# EAGLE design uLI-04 (EAGLE 9.2.2)
AUTHOR: M. Petrilak, J. Horacek; VERSION: 04 r3
Assembly variants: master, slave

## Sheet 1 of 2
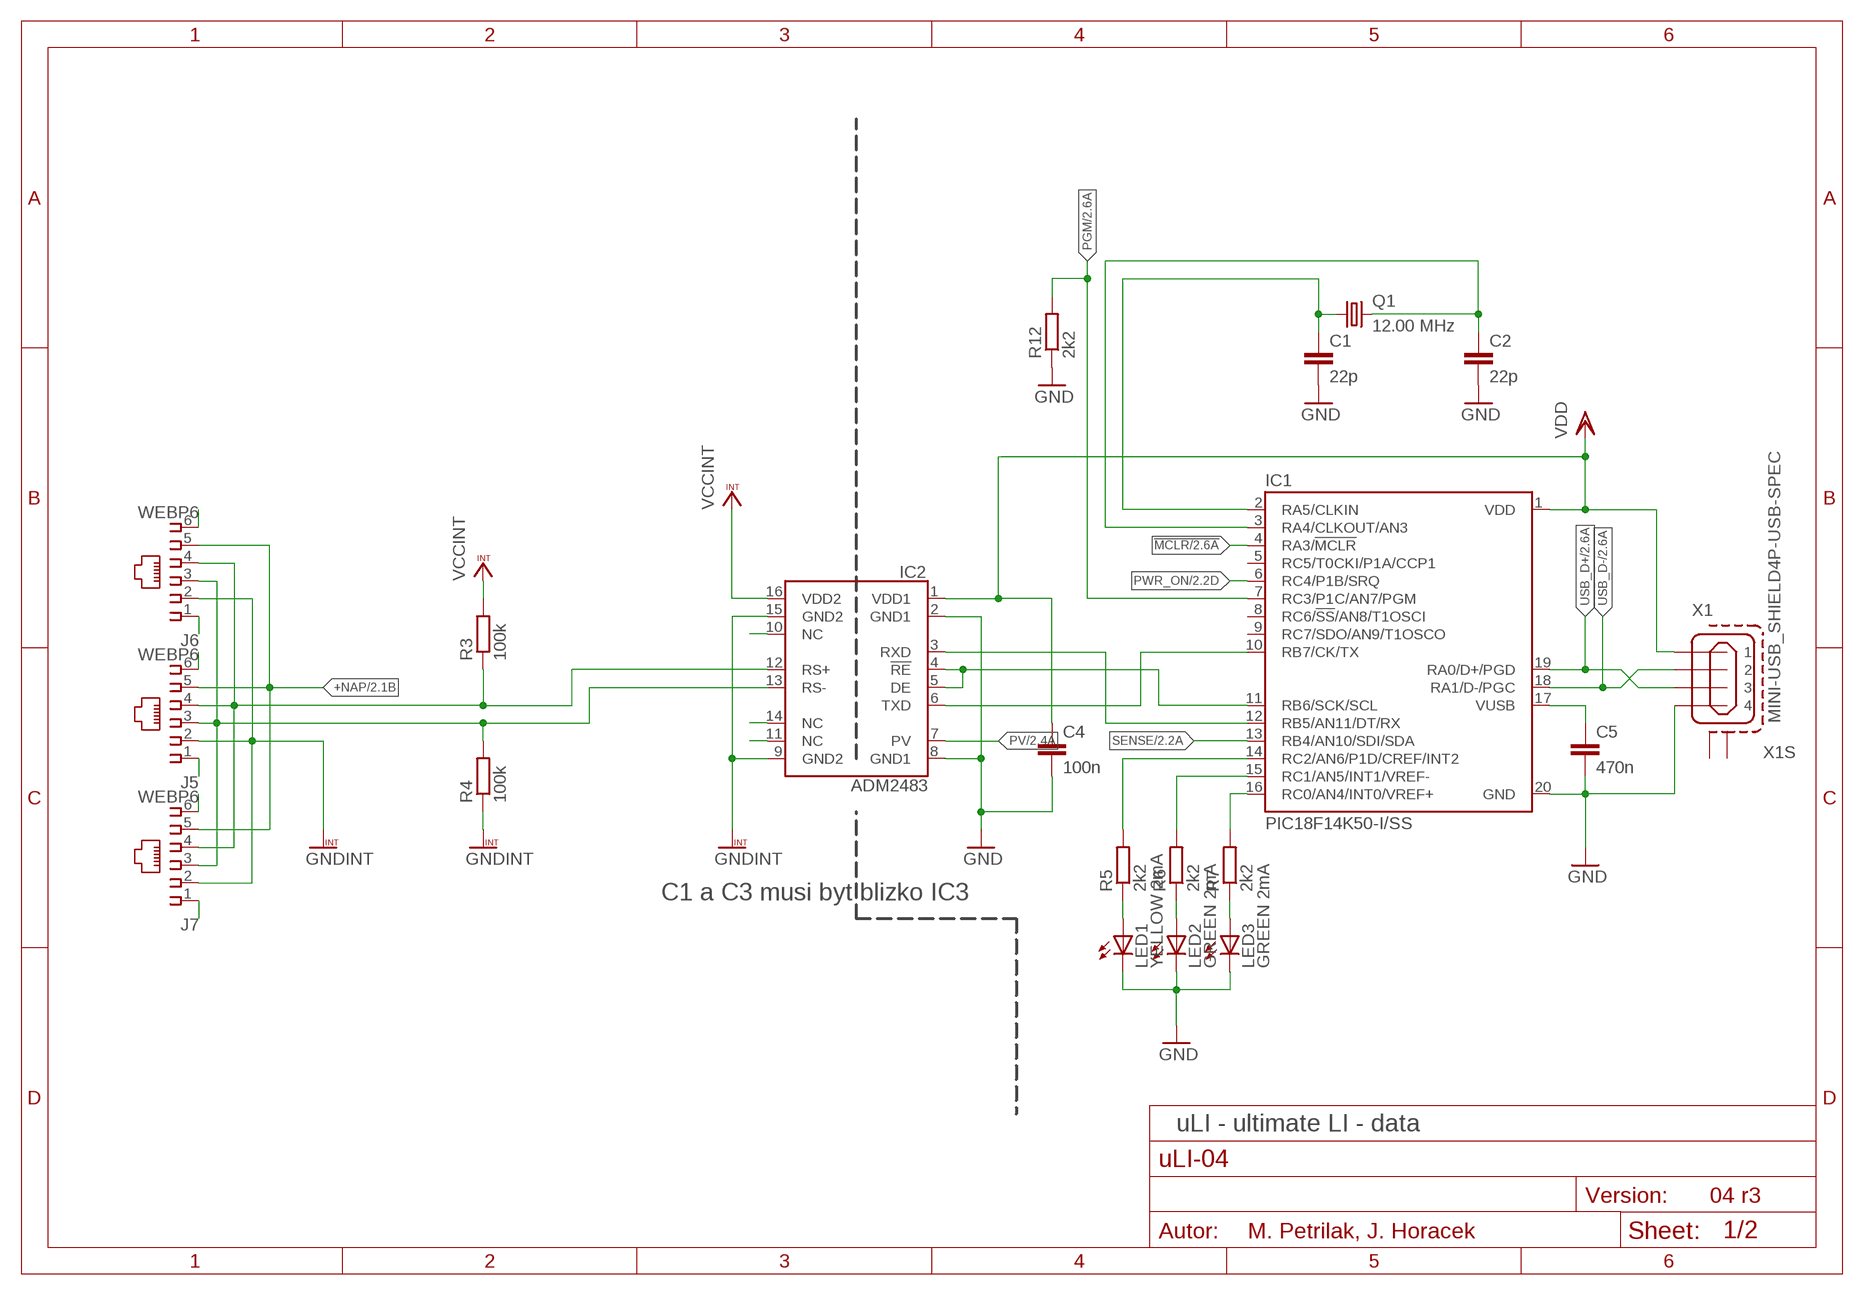
[diagram p0: schematic, sheet 1]

### Parts
C1  22p  C-EUC0805  [C0805]
C2  22p  C-EUC0805  [C0805]
C4  100n  C-EUC1206  [C1206]
C5  470n  C-EUC1206  [C1206]
IC1  PIC18F14K50-I/SS  [SSOP20]
IC2  ADM2483  [SO-16W]
J5  WEBP6  WEBP6-6_SPEC2  [WEBP6-6_SPEC2]  (not fitted in variant slave)
J6  WEBP6  WEBP6-6_SPEC2  [WEBP6-6_SPEC2]  (not fitted in variant slave)
J7  WEBP6  WEBP6-6_SPEC2  [WEBP6-6_SPEC2]  (not fitted in variant master)
LED1  YELLOW 2mA  LED3MM  [LED3MM]
LED2  GREEN 2mA  LED3MM  [LED3MM]
LED3  GREEN 2mA  LED3MM  [LED3MM]
Q1  12.00 MHz  XTAL  [HC49U70]
R3  100k  R-EU_R1206  [R1206]
R4  100k  R-EU_R1206  [R1206]
R5  2k2  R-EU_R1206  [R1206]
R6  2k2  R-EU_R1206  [R1206]
R7  2k2  R-EU_R1206  [R1206]
R12  2k2  R-EU_R1206  [R1206]
X1  MINI-USB_SHIELD4P-USB-SPEC  [85-32004-10X-SPEC]

### Nets
!MCLR: IC1.4(RA3/!MCLR!) ; also sheet 2
+NAP [BUS]: J5.5 J6.5 J7.5 ; also sheet 2
BUS_A [BUS]: IC2.12(RS+) J5.4 J6.4 J7.4 R3.1
BUS_B [BUS]: IC2.13(RS-) J5.3 J6.3 J7.3 R4.2
GND: C1.2 C2.2 C4.2 C5.2 IC1.20(GND) IC2.2(GND1) IC2.8(GND1) LED1.K(C) LED2.K(C) LED3.K(C) R12.1 X1.4 ; also sheet 2
GNDINT [BUS]: IC2.9(GND2) IC2.15(GND2) J5.2 J6.2 J7.2 R4.1 ; also sheet 2
LED1: IC1.14(RC2/AN6/P1D/CREF/INT2) R5.2
LED1_R: LED1.A R5.1
LED2: IC1.15(RC1/AN5/INT1/VREF-) R6.2
LED2_R: LED2.A R6.1
LED3: IC1.16(RC0/AN4/INT0/VREF+) R7.2
LED3_R: LED3.A R7.1
N$2 [BUS]: IC2.11(NC)
N$3 [BUS]: IC2.10(NC)
N$5: IC1.12(RB5/AN11/DT/RX) IC2.3(RXD)
N$8 [BUS]: J6.6
N$11 [BUS]: J6.1
N$12 [BUS]: J5.6
N$13 [BUS]: J5.1
N$14 [BUS]: J7.6
N$15 [BUS]: J7.1
NC2 [BUS]: IC2.14(NC)
PGM: IC1.7(RC3/P1C/AN7/PGM) R12.2 ; also sheet 2
PROC_RX: IC1.10(RB7/CK/TX) IC2.6(TXD)
PROC_TE: IC1.11(RB6/SCK/SCL) IC2.4(!RE) IC2.5(DE)
PV: IC2.7(PV) ; also sheet 2
PWR_ON: IC1.6(RC4/P1B/SRQ) ; also sheet 2
SENSE: IC1.13(RB4/AN10/SDI/SDA) ; also sheet 2
USB_D+: IC1.19(RA0/D+/PGD) X1.3 ; also sheet 2
USB_D-: IC1.18(RA1/D-/PGC) X1.2 ; also sheet 2
VBUS: C5.1 IC1.17(VUSB)
VCCINT [BUS]: IC2.16(VDD2) R3.2 ; also sheet 2
VDD: C4.1 IC1.1(VDD) IC2.1(VDD1) X1.1 ; also sheet 2
XTAL1: C1.1 IC1.2(RA5/CLKIN) Q1.1
XTAL2: C2.1 IC1.3(RA4/CLKOUT/AN3) Q1.2
Unconnected: IC1.5(RC5/T0CKI/P1A/CCP1) IC1.8(RC6/!SS!/AN8/T1OSCI) IC1.9(RC7/SDO/AN9/T1OSCO) X1.M1(S1) X1.M2(S2)

### Notes on the sheet
- C1 a C3 musi byt blizko IC3
- uLI - ultimate LI - data

## Sheet 2 of 2
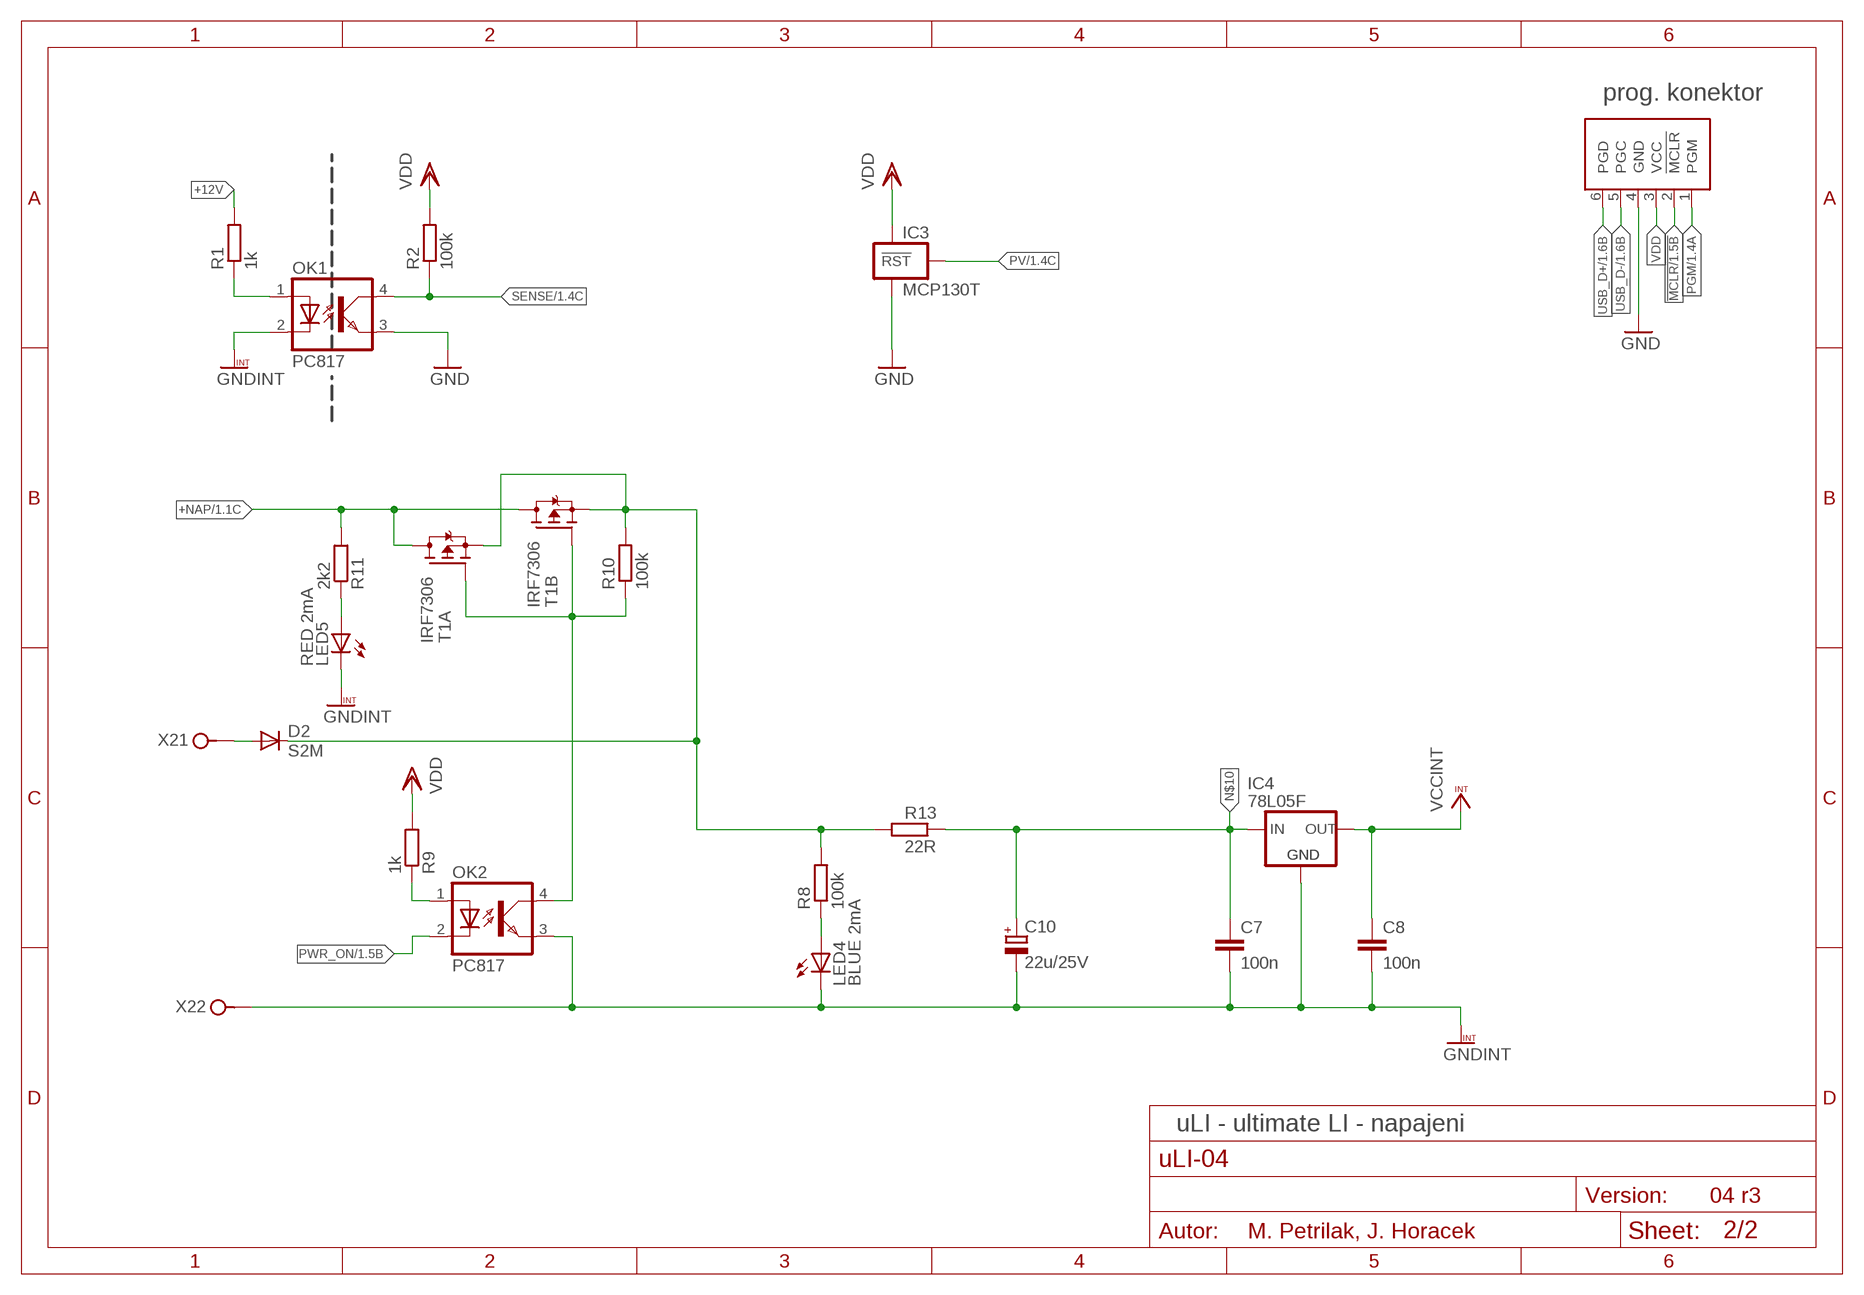
[diagram p1: schematic, sheet 2]

### Parts
C7  100n  C-EUC1206  [C1206]
C8  100n  C-EUC1206  [C1206]
C10  22u/25V  CPOL-EUE2-5  [E2-5]
D2  S2M  [SMB]  (not fitted in variant slave)
IC3  MCP130T  [SOT23]
IC4  78L05F  [SOT89]
J1  PICPROG2-V  [6410-06-PICPROG]
LED4  BLUE 2mA  LED3MM  [LED3MM]  (not fitted in variant slave)
LED5  RED 2mA  LED3MM  [LED3MM]
OK1  PC817  [DIL04]  (not fitted in variant slave)
OK2  PC817  [DIL04]  (not fitted in variant slave)
R1  1k  R-EU_R1206  [R1206]  (not fitted in variant slave)
R2  100k  R-EU_R1206  [R1206]  (not fitted in variant slave)
R8  100k  R-EU_R1206  [R1206]  (not fitted in variant slave)
R9  1k  R-EU_R1206  [R1206]  (not fitted in variant slave)
R10  100k  R-EU_R1206  [R1206]
R11  2k2  R-EU_R1206  [R1206]
R13  22R  R-EU_R1206  [R1206]  (variant master: 0R)
T1  IRF7306  [SO08-IRF]
X2  ARK1550/2_S  [ARK1550/2_SPEC]  (not fitted in variant slave)

### Nets
!MCLR: J1.2(!MCLR) ; also sheet 1
+12V [BUS]: D2.C R1.2 R8.2 R10.2 R13.2 T1.1(A:S) T1.3(B:S)
+NAP [BUS]: R11.2 T1.5(B:D) T1.6(B:D) T1.7(A:D) T1.8(A:D) ; also sheet 1
+NAP2 [BUS]: D2.A X2.1
BUS_SENSE [BUS]: OK1.1(A) R1.1
GND: IC3.3(GND) J1.4(GND) OK1.3(EMIT) ; also sheet 1
GNDINT [BUS]: C7.2 C8.2 C10.- IC4.2(GND) IC4.2@1(GND) LED4.K(C) LED5.K(C) OK1.2(C) OK2.3(EMIT) X2.2 ; also sheet 1
N$1 [BUS]: LED4.A R8.1
N$4 [BUS]: LED5.A R11.1
N$6 [BUS]: OK2.4(COL) R10.1 T1.2(A:G) T1.4(B:G)
N$7: OK2.1(A) R9.1
N$10 [BUS]: C7.1 C10.+ IC4.3(VI) R13.1
PGM: J1.1(PGM) ; also sheet 1
PV: IC3.1(!RST) ; also sheet 1
PWR_ON: OK2.2(C) ; also sheet 1
SENSE: OK1.4(COL) R2.1 ; also sheet 1
USB_D+: J1.6(PGD) ; also sheet 1
USB_D-: J1.5(PGC) ; also sheet 1
VCCINT [BUS]: C8.1 IC4.1(VO) ; also sheet 1
VDD: IC3.2(VCC) J1.3(VCC) R2.2 R9.2 ; also sheet 1

### Notes on the sheet
- prog. konektor
- uLI - ultimate LI - napajeni

## Library data of the parts
C1 C2 C4 C5 C7 C8 = rcl:C-EU: CAPACITOR, European symbol
C10 = rcl:CPOL-EU: POLARIZED CAPACITOR, European symbol
D2 = diode:S2M
IC1 = microchip:PIC18*K50: PIC with USB
IC2 = my:ADM2483
IC3 = my:MCP130T
IC4 = linear:78L*: POSITOIV-VOLTAGE REGULATORS Output up to 100 mA Source: http://focus.ti.com/lit/ds/symlink/ua78l05.pdf
J1 = con-molex:PICPROG2
J5-J7 = con-malina:WEBP6-6
LED1-LED5 = led:LED: LED OSRAM: - CHIPLED LG R971, LG N971, LY N971, LG Q971, LY Q971, LO R971, LY R971 LH N974, LH R974 LS Q976, LO Q976, LY Q976 LO Q996 - Hyper CHIPLED LW Q18S LB Q993, LB Q99A, LB R99A - SideLED LS A670, LO A670, LY A670, LG A670, LP A670 LB A673, LV A673, LT A673, LW A673 LH A674 LY A675 LS A676, LA A676, LO A676, LY A676, LW A676 LS A679, LY A679, LG A679 - Hyper Micro SIDELED® LS Y876, LA Y876, LO Y876, LY Y876 LT Y87S - SmartLED LW L88C, LW L88S LB L89C, LB L89S, LG L890 LS L89K, LO L89K, LY L89K LS L896, LA L896, LO L896, LY L896 - TOPLED LS T670, LO T670, LY T670, LG T670, LP T670 LSG T670, LSP T670, LSY T670, LOP T670, LYG T670 LG T671, LOG T671, LSG T671 LB T673, LV T673, LT T673, LW T673 LH T674 LS T676, LA T676, LO T676, LY T676, LB T676, LH T676, LSB T676, LW T676 LB T67C, LV T67C, LT T67C, LS T67K, LO T67K, LY T67K, LW E67C LS E67B, LA E67B, LO E67B, LY E67B, LB E67C, LV E67C, LT E67C LW T67C LS T679, LY T679, LG T679 LS T770, LO T770, LY T770, LG T770, LP T770 LB T773, LV T773, LT T773, LW T773 LH T774 LS E675, LA E675, LY E675, LS T675 LS T776, LA T776, LO T776, LY T776, LB T776 LHGB T686 LT T68C, LB T68C - Hyper Mini TOPLED® LB M676 - Mini TOPLED Santana® LG M470 LS M47K, LO M47K, LY M47K Source: http://www.osram.convergy.de LUXEON: - LUMILED® LXK2-PW12-R00, LXK2-PW12-S00, LXK2-PW14-U00, LXK2-PW14-V00 LXK2-PM12-R00, LXK2-PM12-S00, LXK2-PM14-U00 LXK2-PE12-Q00, LXK2-PE12-R00, LXK2-PE12-S00, LXK2-PE14-T00, LXK2-PE14-U00 LXK2-PB12-K00, LXK2-PB12-L00, LXK2-PB12-M00, LXK2-PB14-N00, LXK2-PB14-P00, LXK2-PB14-Q00 LXK2-PR12-L00, LXK2-PR12-M00, LXK2-PR14-Q00, LXK2-PR14-R00 LXK2-PD12-Q00, LXK2-PD12-R00, LXK2-PD12-S00 LXK2-PH12-R00, LXK2-PH12-S00 LXK2-PL12-P00, LXK2-PL12-Q00, LXK2-PL12-R00 Source: www.luxeon.com KINGBRIGHT: KA-3528ASYC Source: www.kingbright.com
OK1 OK2 = optocoupler:PC817: SHARP OPTO COUPLER
Q1 = crystal:XTAL
R1-R13 = rcl:R-EU_: RESISTOR, European symbol
T1 = transistor-fet:IRF7306
X1 = con-cypressindustries:MINI-USB_SHIELD4P-: MINI USB 4 Pol. Source: www.cypressindustries.com
X2 = con-malina:ARK1550/2

## Net classes
0 default: width 0.3 mm
1 BUS: clearance 3 mm to class 0

## Board
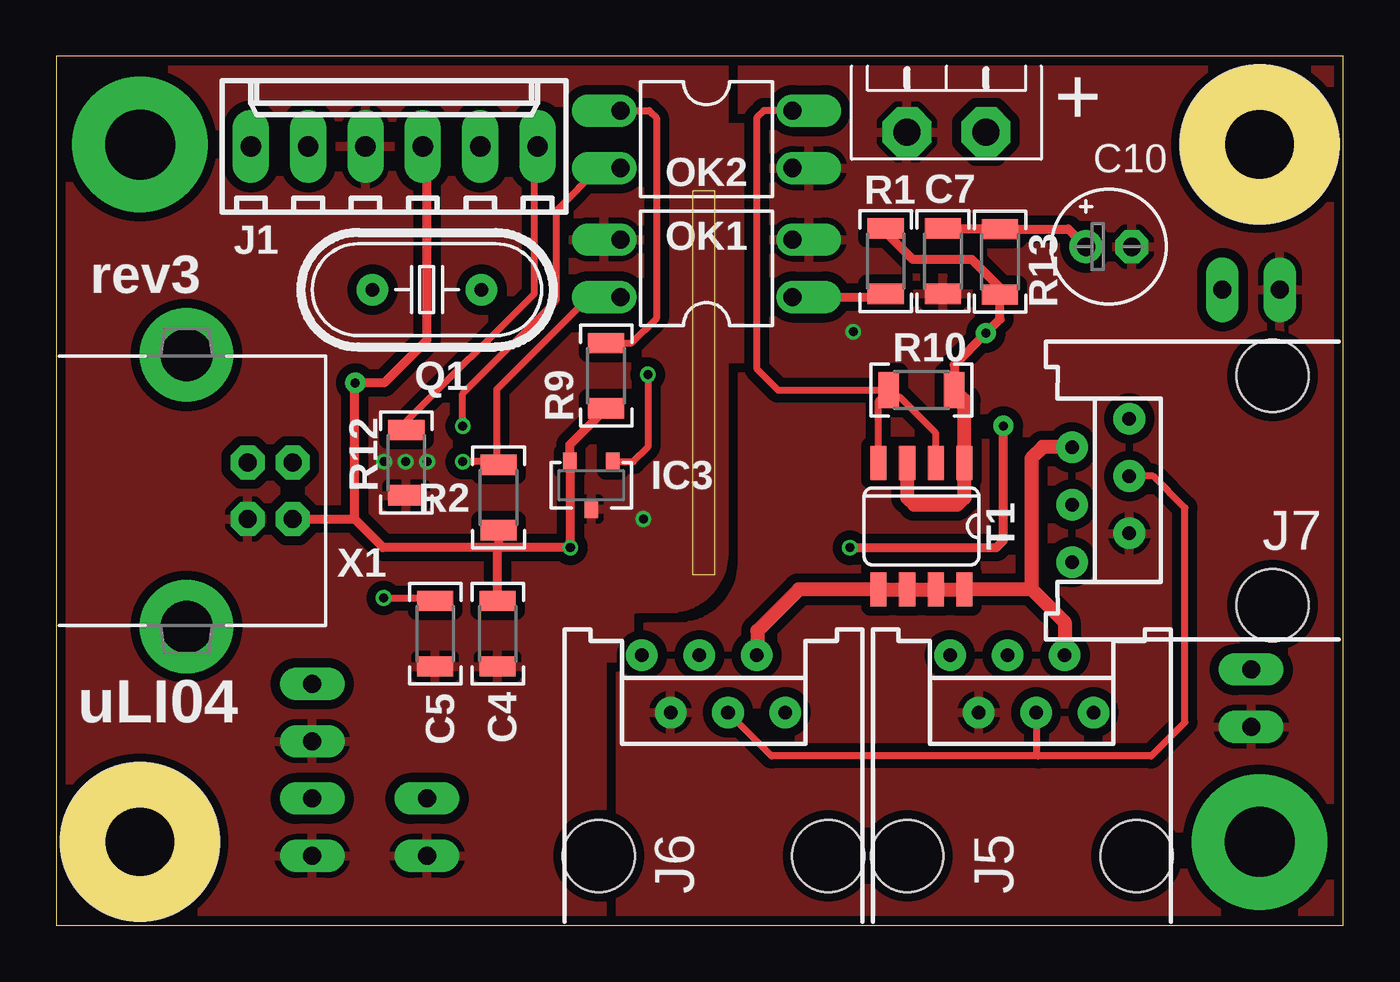
[diagram p2: board, top side]
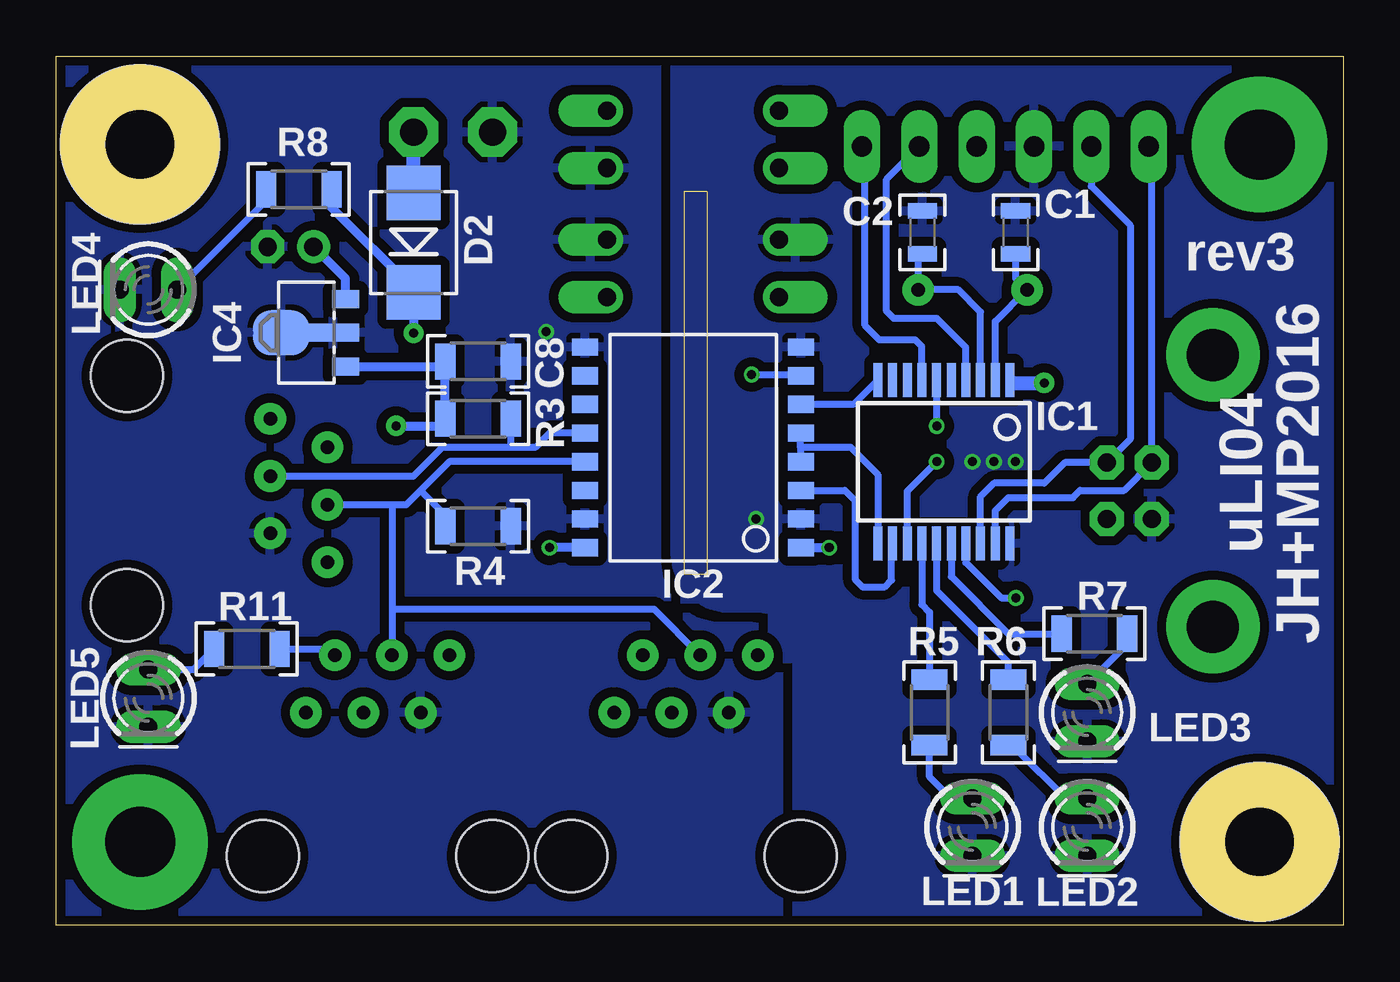
[diagram p3: board, bottom side, seen from below]

Size 57 x 38.5 mm. Coordinates in mm from the lower left corner, seen from the top.
Outline: 0,0 57,0 57,38.5 0,38.5 0,0
Copper layers (1*16): Top 0.035mm / dielectric 1.6mm / Bottom 0.035mm
Design rules "jlcpcb-2layers": minimum track width 5mil, minimum drill 0.3mm, track to track 5mil, track to pad 5mil, pad to pad 5mil, via to via 5mil, smd to smd 5mil, copper to edge 0.2mm, drill to drill 6mil, minimum pad ring 10mil, minimum via ring 3mil, stop-mask expansion 4mil, vias tented up to drill 0mil, thermal gap 10mil
Holes 7 mm at 3.7,3.7 53.3,34.6
Milling: area 1.2,1.2 to 6.2,6.2; area 50.8,32.1 to 55.8,37.1; 4 lines

### Footprints (pad centres in the part's own frame; a part is rotated, then mirrored left to right if it is on the bottom)
C0805 = smd 0.7 x 1.3: 1 -0.95,0; 2 0.95,0
C1206 = smd 0.9 x 1.6: 1 -1.45,0; 2 1.45,0
E2-5 = drill 0.813 pad 1.422: + -1.016,0 | drill 0.813 pad 1.422 octagon: - 1.016,0
SMB = smd 2.4 x 2.4: A 2.2,0; C -2.2,0
SSOP20 = smd 0.4 x 1.5: 1 -2.925,-3.625; 2 -2.275,-3.625; 3 -1.625,-3.625; 4 -0.975,-3.625; 5 -0.325,-3.625; 6 0.325,-3.625; 7 0.975,-3.625; 8 1.625,-3.625; 9 2.275,-3.625; 10 2.925,-3.625; 11 2.925,3.625; 12 2.275,3.625; 13 1.625,3.625; 14 0.975,3.625; 15 0.325,3.625; 16 -0.325,3.625; 17 -0.975,3.625; 18 -1.625,3.625; 19 -2.275,3.625; 20 -2.925,3.625
SO-16W = smd 0.762 x 1.143: 1 -5.08,-4.788; 2 -3.81,-4.788; 3 -2.54,-4.788; 4 -1.27,-4.788; 5 0,-4.788; 6 1.27,-4.788; 7 2.54,-4.788; 8 3.81,-4.788; 9 3.81,4.788; 10 2.54,4.788; 11 1.27,4.788; 12 0,4.788; 13 -1.27,4.788; 14 -2.54,4.788; 15 -3.81,4.788; 16 -5.08,4.788
SOT23 = smd 0.6 x 0.8: 1 -0.95,-1.05; 2 0.95,-1.05; 3 0,1.05
SOT89 = smd 0.8 x 1.2: 1 -1.5,-1.75; 3 1.499,-1.75 | smd 0.8 x 2.3: 2 0,-1.2 | smd 2 x 2.5: 2@1 0,1.1
6410-06-PICPROG = drill 0.9 long: 1 6.35,0; 2 3.81,0; 3 1.27,0; 4 -1.27,0; 5 -3.81,0; 6 -6.35,0
WEBP6-6_SPEC2 = drill 0.6 pad 1.4: 1 -3.175,8.89; 2 -1.905,6.35; 3 -0.635,8.89; 4 0.635,6.35; 5 1.905,8.89; 6 3.175,6.35 | hole 3.2: -5.08,0; 5.08,0
LED3MM = drill 0.8 pad 1.4 long: A -1.27,0; K 1.27,0
DIL04 = drill 0.8 pad 1.4 offset: 1 -1.27,-3.81; 2 1.27,-3.81; 3 1.27,3.81; 4 -1.27,3.81
HC49U70 = drill 0.6 pad 1.4: 1 -2.413,0; 2 2.413,0
R1206 = smd 0.9 x 1.6: 1 -1.45,0; 2 1.45,0
SO08-IRF = smd 0.72 x 1.5: 1 -1.905,-2.8; 2 -0.635,-2.8; 3 0.635,-2.8; 4 1.905,-2.8; 5 1.905,2.8; 6 0.635,2.8; 7 -0.635,2.8; 8 -1.905,2.8
85-32004-10X-SPEC = drill 0.8 pad 1.5 octagon: 1 4.71,-1.25; 2 4.71,1.25; 3 2.71,1.25; 4 2.71,-1.25 | drill 2.3 pad 3: M1 0,6.02; M2 0,-6.02
ARK1550/2_SPEC = drill 1.2 pad 2.184 octagon: 1 0,0; 2 3.5,0

### Placement (x,y rotation side)
C1  14.51,30.7 90 bottom
C2  18.64,30.7 90 bottom
C4  19.55,12.92 270 top
C5  16.78,12.92 270 top
C7  39.27,29.43 270 top
C8  38.32,24.99 0 bottom
C10  46.62,30.07 0 top
D2  41.18,30.25 90 bottom
IC1  17.68,20.54 180 bottom
IC2  28.8,21.81 90 bottom
IC3  MCP130T-3V  [SOT23]  23.7,19.5 180 top
IC4  45.94,26.26 90 bottom
J1  14.96,34.51 0 top
J5  42.77,3.08 0 top
J6  29.11,3.08 0 top
J7  53.88,19.27 90 top
LED1  16.41,4.35 270 bottom
LED2  11.34,4.35 270 bottom
LED3  11.34,9.43 270 bottom
LED4  52.93,28.16 180 bottom
LED5  52.93,10.06 270 bottom
OK1  28.8,29.11 90 top
OK2  28.8,34.83 270 top
Q1  16.41,28.16 0 top
R1  36.73,29.43 90 top
R2  19.59,18.95 270 top
R3  38.32,22.45 180 bottom
R4  38.32,17.68 180 bottom
R5  18.32,9.43 90 bottom
R6  14.83,9.43 90 bottom
R7  11.02,12.92 180 bottom
R8  46.26,32.61 0 bottom
R9  24.35,24.35 270 top
R10  38.32,23.72 0 top
R11  48.56,12.25 0 bottom
R12  15.5,20.5 90 top
R13  41.8,29.4 270 top
T1  38.32,17.68 180 top
X1  5.76,19.25 0 top
X2  41.18,35.15 180 top

### Tracks (layer width: path | path; a pad name or v marks a point on that pad's centre or on a via)
!MCLR
  Bottom 0.305: IC1.4 16.71,25.6 18,26.89 19.91,26.89 20.23,27.21 20.23,33.06 J1.2
+12V  (via drill 0.4 pad 0.9)
  Top 0.406: R1.2 36.8,30.82 36.8,30.65 37.95,29.5 40.55,29.5 41.8,28.25 R13.2 41.8,26.86 v41.18,26.24 39.77,24.83 R10.2
  Top 0.61: T1.3 37.69,18.95 38.01,18.64 39.91,18.64 40.23,18.95 T1.1 40.23,23.26 R10.2
  Bottom 0.406: v41.18,26.24 D2.C 41.18,28.18 44.81,31.81 R8.2
+NAP
  Top 0.61: J7.5 44.97,21.2 43.7,21.2 43.2,20.7 43.2,14.9 | 43.2,14.9 41.77,14.9 41.76,14.89 T1.8 T1.7 T1.6 T1.5 32.88,14.89 31.05,13.05 31.05,12 J6.5 | 43.2,14.9 44.67,13.43 J5.5
  Bottom 0.305: R11.2 44.95,12.25 J5.5
+NAP2
  Bottom 0.61: D2.A X2.1
BUS_A
  Top 0.305: J6.4 31.68,7.5 43.5,7.5 | 43.5,7.5 48.5,7.5 50,9 50,18.5 48.59,19.91 J7.4 | J5.4 43.4,7.6 43.5,7.5
  Bottom 0.305: IC2.12 35.15,21.81 35.78,21.18 36.73,21.18 | 36.73,21.18 39.91,21.18 41.18,19.91 J7.4 47.53,19.73 | R3.1 36.87,21.32 36.73,21.18
BUS_B
  Bottom 0.305: IC2.13 39.59,20.54 40.86,19.27 | R4.2 39.77,18.18 40.86,19.27 | J7.3 42.1,18.64 | 42.1,18.64 41.5,18.64 40.86,19.27 | J5.3 42.1,12 42.1,14 | 42.1,14 42.1,18.64 | J6.3 30.51,14 42.1,14
BUS_SENSE
  Top 0.406: OK1.1 36.6,27.84 R1.1
GND  (via drill 0.4 pad 0.7)
  other vias: 26,18 15.46,20.54 14.51,20.54 16.41,20.54
  pour Top (isolate 0.406, rank 6): 0,0 57,0 57,38.5 0,38.5
  pour Bottom (isolate 0.406, rank 6): 0,0 57,0 57,38.5 0,38.5
GNDINT  (via drill 0.4 pad 0.7)
  other vias: 35.3,26.3
  pour Top (isolate 0.406): 30.38,38.5 57,38.5 57,0 24.99,0 24.99,11.93 arc-90 26.3,13.24 27.55,13.24 arc90 30.38,16.08
  pour Bottom (isolate 0.406, rank 2): 30.38,38.5 57,38.5 57,0 24.99,0 24.99,11.93 arc-90 26.3,13.24 27.55,13.24 arc90 30.38,16.08
LED1
  Bottom 0.305: IC1.14 18.66,14.21 18.32,13.88 R5.2
LED1_R
  Bottom 0.305: R5.1 18.32,6.57 17.37,5.62 LED1.A
LED2
  Bottom 0.305: R6.2 14.83,11.65 18.01,14.84 IC1.15
LED2_R
  Bottom 0.305: R6.1 14.51,7.84 12.29,5.62 LED2.A
LED3
  Bottom 0.305: IC1.16 17.36,15.45 14.83,12.92 R7.2
LED3_R
  Bottom 0.305: R7.1 9.57,12.47 LED3.A
N$1
  Bottom 0.305: R8.1 47.71,32.11 LED4.A
N$4
  Bottom 0.305: LED5.A 50.93,11.34 R11.1
N$5
  Bottom 0.305: IC2.3 22.07,19.27 21.6,18.8 21.6,15.3 21.3,15 20.3,15 20,15.3 20,16.88 IC1.12
N$6
  Top 0.305: OK2.4 31.34,36.1 31.02,35.78 31.02,24.67 31.97,23.72 R10.1 | T1.4 36.42,23.26 R10.1 | T1.2 38.96,21.81 37.37,23.4 37.19,23.4 R10.1
N$7
  Top 0.305: OK2.1 26.26,36.1 26.57,35.78 26.57,26.89 25.48,25.8 R9.1
N$9  (via drill 3.1 pad 6)
  other vias: 3.7,34.6
N$10
  Top 0.406: C10.+ 44.83,30.85 R13.1 39.31,30.85 C7.1
  Bottom 0.406: IC4.3 44.19,28.65 C10.+
N$18  (via drill 3.1 pad 6)
  other vias: 53.3,3.7
PGM
  Top 0.305: R12.2 15.5,22.32 21.18,28 21.18,34.38 J1.1
  Bottom 0.305: IC1.7 18.66,25.64 18.95,25.94 20.54,25.94 21.18,26.57 21.18,34.38 J1.1
PROC_RX
  Bottom 0.305: IC2.6 21.7,23.08 IC1.10
PROC_TE
  Bottom 0.305: IC1.11 20.61,19.98 21.81,21.18 24.04,21.18 | 24.04,21.18 24.04,21.79 IC2.5 | 24.04,21.18 24.04,20.57 IC2.4
PV  (via drill 0.4 pad 0.7)
  Top 0.305: IC3.1 25.55,20.55 26.2,21.2 v26.2,24.4
  Bottom 0.305: v26.2,24.4 24.06,24.4 IC2.7
PWR_ON  (via drill 0.4 pad 0.7)
  Top 0.305: v18,22.13 18,23.55 22.13,27.68 22.13,31.66 24.04,33.56 OK2.2
  Bottom 0.305: IC1.6 v18.01,22.14 v18,22.13
SENSE  (via drill 0.4 pad 0.7)
  Top 0.305: v18,20.54 19.45,20.54 R2.1 19.5,20.5 19.5,23.75 23.59,27.84 OK1.4
  Bottom 0.305: IC1.13 19.31,19.23 v18,20.54
USB_D+
  Bottom 0.305: IC1.19 15.41,18.37 14.83,18.95 11.97,18.95 11.65,19.27 9.7,19.27 X1.3 8.47,34.37 J1.6
USB_D-
  Bottom 0.305: IC1.18 16.06,18.99 15.46,19.59 13.24,19.59 12.33,20.5 X1.2 9.43,21.54 9.43,31.02 11.15,32.74 J1.5
VBUS  (via drill 0.4 pad 0.7)
  Top 0.305: v14.5,14.5 16.65,14.5 C5.1
  Bottom 0.305: IC1.17 16.71,16.07 15.14,14.51 v14.51,14.51 v14.5,14.5
VCCINT  (via drill 0.4 pad 0.7, 0.4 pad 0.9)
  Top 0.406: v35.15,16.73 41.63,16.73 41.95,17.05 v41.95,22.13
  Bottom 0.406: IC4.1 40,24.76 C8.1 R3.2 40.09,22.13 v41.95,22.13 | IC2.16 v35.15,16.73
VDD  (via drill 0.4 pad 0.7, 0.4 pad 0.9)
  Top 0.406: 19.59,16.73 v22.77,16.73 22.77,20.54 IC3.2 22.75,21.3 R9.2 | 19.59,16.73 19.55,16.73 | R2.2 19.59,16.73 | C4.1 19.55,16.73 | 19.55,16.73 14.47,16.73 13.2,18 | X1.1 13.2,18 | 13.2,18 13.2,24 v13.24,24.04 14.51,24.04 16.41,25.94 16.41,34.33 J1.3
  Bottom 0.305: IC1.1 14.63,24.04
  Bottom 0.406: IC2.1 v22.77,16.73
  Bottom 0.61: 14.63,24.04 v13.24,24.04
XTAL1
  Bottom 0.305: IC1.2 15.41,26.75 Q1.1 14.51,28.67 C1.1
XTAL2
  Bottom 0.305: IC1.3 16.06,27.17 17.05,28.16 Q1.2 18.83,29.56 C2.1

### Text on the board
tPlace: +
tNames: rev3 | uLI04
bNames: rev3 | uLI04 | JH+MP2016